# Altium schematic sheet QCopterMV_MCU_Sch.SchDoc: QCopterMV-MCU
size 177 x 203 mm; Author: Hom; CompanyName: KitSprout; DrawnBy: Hom; Engineer: Hom; Organization: KitSprout; Revision: A; SheetNumber: 1; SheetTotal: 1; License: CC BY-SA 4.0; Version: 2.0; LibVersion: 2.7; PageSetup: Record=PageOptions|CenterHorizontal=True|CenterVertical=True|PrintScale=1.00|XCorrection=1.00|YCorrection=1.00|PrintKind=0|BorderSize=5000000|LeftOffset=0|BottomOffset=0|Orientation=2|PaperLength=1000|PaperWidth=1000|Scale=100|PaperSource=7|PrintQuality=-4|MediaType=1|DitherType=10|PaperKind=A4|PrintScaleMode=0
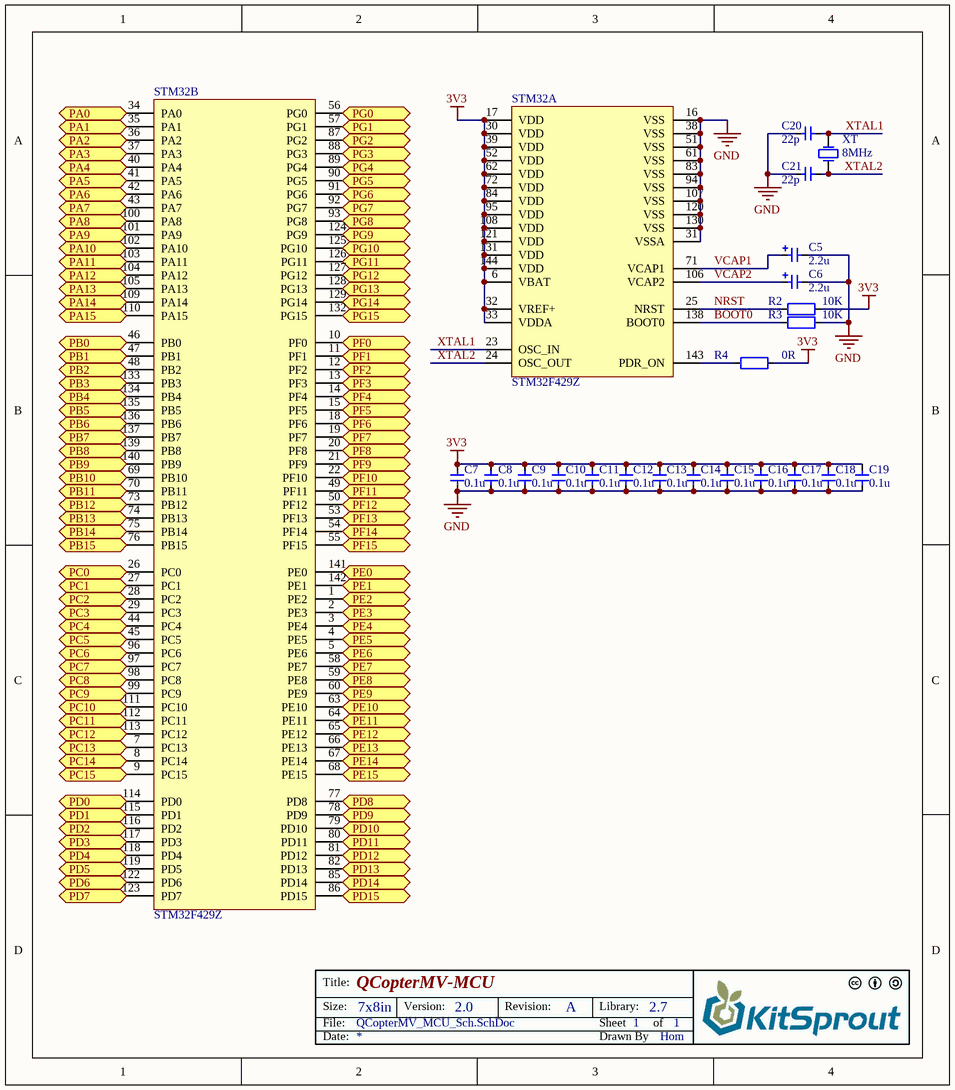
[diagram p0: QCopterMV_MCU_Sch.SchDoc]

## Parts
C5  value 2.2u  [CAP_TAN_P0805]  (hidden comment: Cap_Tan_0805)
C6  value 2.2u  [CAP_TAN_P0805]  (hidden comment: Cap_Tan_0805)
C7  value 0.1u  [CAP_0402]  (hidden comment: Cap_0402)
C8  value 0.1u  [CAP_0402]  (hidden comment: Cap_0402)
C9  value 0.1u  [CAP_0402]  (hidden comment: Cap_0402)
C10  value 0.1u  [CAP_0402]  (hidden comment: Cap_0402)
C11  value 0.1u  [CAP_0402]  (hidden comment: Cap_0402)
C12  value 0.1u  [CAP_0402]  (hidden comment: Cap_0402)
C13  value 0.1u  [CAP_0402]  (hidden comment: Cap_0402)
C14  value 0.1u  [CAP_0402]  (hidden comment: Cap_0402)
C15  value 0.1u  [CAP_0402]  (hidden comment: Cap_0402)
C16  value 0.1u  [CAP_0402]  (hidden comment: Cap_0402)
C17  value 0.1u  [CAP_0402]  (hidden comment: Cap_0402)
C18  value 0.1u  [CAP_0402]  (hidden comment: Cap_0402)
C19  value 0.1u  [CAP_0402]  (hidden comment: Cap_0402)
C20  value 22p  [CAP_0402]  (hidden comment: Cap_0402)
C21  value 22p  [CAP_0402]  (hidden comment: Cap_0402)
R2  value 10K  [RES_0402]  (hidden comment: Res_0402)
R3  value 10K  [RES_0402]  (hidden comment: Res_0402)
R4  value 0R  [RES_0402]  (hidden comment: Res_0402)
STM32  STM32F429Z  [LQFP_P0.5_144]  (parts A,B of 2)
XT  value 8MHz  [XT_3225_2]  (hidden comment: XTAL_3225_2P)

## Ports
PA0, PA1, PA2, PA3, PA4, PA5, PA6, PA7, PA8, PA9, PA10, PA11, PA12, PA13, PA14, PA15, PB0, PB1, PB2, PB3, PB4, PB5, PB6, PB7, PB8, PB9, PB10, PB11, PB12, PB13, PB14, PB15, PC0, PC1, PC2, PC3, PC4, PC5, PC6, PC7, PC8, PC9, PC10, PC11, PC12, PC13, PC14, PC15, PD0, PD1, PD2, PD3, PD4, PD5, PD6, PD7, PD8, PD9, PD10, PD11, PD12, PD13, PD14, PD15, PE0, PE1, PE2, PE3, PE4, PE5, PE6, PE7, PE8, PE9, PE10, PE11, PE12, PE13, PE14, PE15, PF0, PF1, PF2, PF3, PF4, PF5, PF6, PF7, PF8, PF9, PF10, PF11, PF12, PF13, PF14, PF15, PG0, PG1, PG2, PG3, PG4, PG5, PG6, PG7, PG8, PG9, PG10, PG11, PG12, PG13, PG14, PG15

## Nets
3V3: C7.2 C8.2 C9.2 C10.2 C11.2 C12.2 C13.2 C14.2 C15.2 C16.2 C17.2 C18.2 C19.2 R2.1 R4.1 STM32.6(VBAT) STM32.17(VDD) STM32.30(VDD) STM32.32(VREF+) STM32.33(VDDA) STM32.39(VDD) STM32.52(VDD) STM32.62(VDD) STM32.72(VDD) STM32.84(VDD) STM32.95(VDD) STM32.108(VDD) STM32.121(VDD) STM32.131(VDD) STM32.144(VDD)
GND: C5.2 C6.2 C7.1 C8.1 C9.1 C10.1 C11.1 C12.1 C13.1 C14.1 C15.1 C16.1 C17.1 C18.1 C19.1 C20.1 C21.1 R3.1 STM32.16(VSS) STM32.31(VSSA) STM32.38(VSS) STM32.51(VSS) STM32.61(VSS) STM32.83(VSS) STM32.94(VSS) STM32.107(VSS) STM32.120(VSS) STM32.130(VSS)
BOOT0: R3.2 STM32.138(BOOT0)
NRST: R2.2 STM32.25(NRST)
PA0: STM32.34(PA0) ; port PA0
PA1: STM32.35(PA1) ; port PA1
PA2: STM32.36(PA2) ; port PA2
PA3: STM32.37(PA3) ; port PA3
PA4: STM32.40(PA4) ; port PA4
PA5: STM32.41(PA5) ; port PA5
PA6: STM32.42(PA6) ; port PA6
PA7: STM32.43(PA7) ; port PA7
PA8: STM32.100(PA8) ; port PA8
PA9: STM32.101(PA9) ; port PA9
PA10: STM32.102(PA10) ; port PA10
PA11: STM32.103(PA11) ; port PA11
PA12: STM32.104(PA12) ; port PA12
PA13: STM32.105(PA13) ; port PA13
PA14: STM32.109(PA14) ; port PA14
PA15: STM32.110(PA15) ; port PA15
PB0: STM32.46(PB0) ; port PB0
PB1: STM32.47(PB1) ; port PB1
PB2: STM32.48(PB2) ; port PB2
PB3: STM32.133(PB3) ; port PB3
PB4: STM32.134(PB4) ; port PB4
PB5: STM32.135(PB5) ; port PB5
PB6: STM32.136(PB6) ; port PB6
PB7: STM32.137(PB7) ; port PB7
PB8: STM32.139(PB8) ; port PB8
PB9: STM32.140(PB9) ; port PB9
PB10: STM32.69(PB10) ; port PB10
PB11: STM32.70(PB11) ; port PB11
PB12: STM32.73(PB12) ; port PB12
PB13: STM32.74(PB13) ; port PB13
PB14: STM32.75(PB14) ; port PB14
PB15: STM32.76(PB15) ; port PB15
PC0: STM32.26(PC0) ; port PC0
PC1: STM32.27(PC1) ; port PC1
PC2: STM32.28(PC2) ; port PC2
PC3: STM32.29(PC3) ; port PC3
PC4: STM32.44(PC4) ; port PC4
PC5: STM32.45(PC5) ; port PC5
PC6: STM32.96(PC6) ; port PC6
PC7: STM32.97(PC7) ; port PC7
PC8: STM32.98(PC8) ; port PC8
PC9: STM32.99(PC9) ; port PC9
PC10: STM32.111(PC10) ; port PC10
PC11: STM32.112(PC11) ; port PC11
PC12: STM32.113(PC12) ; port PC12
PC13: STM32.7(PC13) ; port PC13
PC14: STM32.8(PC14) ; port PC14
PC15: STM32.9(PC15) ; port PC15
PD0: STM32.114(PD0) ; port PD0
PD1: STM32.115(PD1) ; port PD1
PD2: STM32.116(PD2) ; port PD2
PD3: STM32.117(PD3) ; port PD3
PD4: STM32.118(PD4) ; port PD4
PD5: STM32.119(PD5) ; port PD5
PD6: STM32.122(PD6) ; port PD6
PD7: STM32.123(PD7) ; port PD7
PD8: STM32.77(PD8) ; port PD8
PD9: STM32.78(PD9) ; port PD9
PD10: STM32.79(PD10) ; port PD10
PD11: STM32.80(PD11) ; port PD11
PD12: STM32.81(PD12) ; port PD12
PD13: STM32.82(PD13) ; port PD13
PD14: STM32.85(PD14) ; port PD14
PD15: STM32.86(PD15) ; port PD15
PE0: STM32.141(PE0) ; port PE0
PE1: STM32.142(PE1) ; port PE1
PE2: STM32.1(PE2) ; port PE2
PE3: STM32.2(PE3) ; port PE3
PE4: STM32.3(PE4) ; port PE4
PE5: STM32.4(PE5) ; port PE5
PE6: STM32.5(PE6) ; port PE6
PE7: STM32.58(PE7) ; port PE7
PE8: STM32.59(PE8) ; port PE8
PE9: STM32.60(PE9) ; port PE9
PE10: STM32.63(PE10) ; port PE10
PE11: STM32.64(PE11) ; port PE11
PE12: STM32.65(PE12) ; port PE12
PE13: STM32.66(PE13) ; port PE13
PE14: STM32.67(PE14) ; port PE14
PE15: STM32.68(PE15) ; port PE15
PF0: STM32.10(PF0) ; port PF0
PF1: STM32.11(PF1) ; port PF1
PF2: STM32.12(PF2) ; port PF2
PF3: STM32.13(PF3) ; port PF3
PF4: STM32.14(PF4) ; port PF4
PF5: STM32.15(PF5) ; port PF5
PF6: STM32.18(PF6) ; port PF6
PF7: STM32.19(PF7) ; port PF7
PF8: STM32.20(PF8) ; port PF8
PF9: STM32.21(PF9) ; port PF9
PF10: STM32.22(PF10) ; port PF10
PF11: STM32.49(PF11) ; port PF11
PF12: STM32.50(PF12) ; port PF12
PF13: STM32.53(PF13) ; port PF13
PF14: STM32.54(PF14) ; port PF14
PF15: STM32.55(PF15) ; port PF15
PG0: STM32.56(PG0) ; port PG0
PG1: STM32.57(PG1) ; port PG1
PG2: STM32.87(PG2) ; port PG2
PG3: STM32.88(PG3) ; port PG3
PG4: STM32.89(PG4) ; port PG4
PG5: STM32.90(PG5) ; port PG5
PG6: STM32.91(PG6) ; port PG6
PG7: STM32.92(PG7) ; port PG7
PG8: STM32.93(PG8) ; port PG8
PG9: STM32.124(PG9) ; port PG9
PG10: STM32.125(PG10) ; port PG10
PG11: STM32.126(PG11) ; port PG11
PG12: STM32.127(PG12) ; port PG12
PG13: STM32.128(PG13) ; port PG13
PG14: STM32.129(PG14) ; port PG14
PG15: STM32.132(PG15) ; port PG15
VCAP1: C5.1 STM32.71(VCAP1)
VCAP2: C6.1 STM32.106(VCAP2)
XTAL1: C20.2 STM32.23(OSC_IN) XT.2(OSC2)
XTAL2: C21.2 STM32.24(OSC_OUT) XT.1(OSC1)
NetR4_2: R4.2 STM32.143(PDR_ON)

## Notes on the sheet
- Title:
- Size:
- Date:
- File:
- 7x8in
- Version:
- Revision:
- Sheet
- Drawn By
- Library:
- of

## Library data of the parts
C5 C6 = Cap_Tan_0805: Capacitor
C7-C21 = Cap_0402: Capacitor
R2-R4 = Res_0402: Resistor
STM32 = STM32F439Z: MCU
XT = XTAL_3225_2P: Crystal Oscillator